# EAGLE schematic Moinak_BLDC (EAGLE 6.5.0)
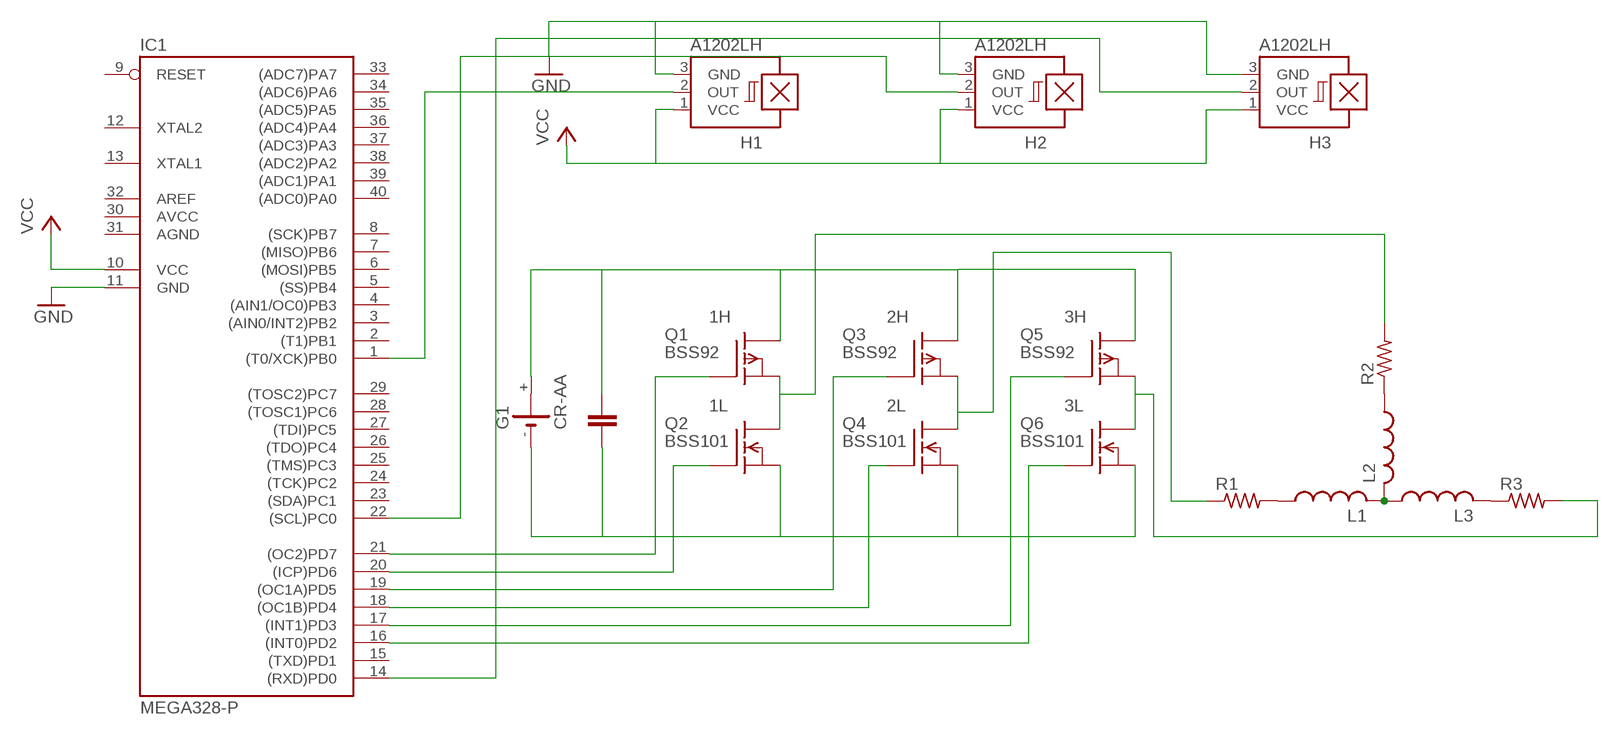
[diagram p0: schematic, sheet 1]

## Parts
G1  CR-AA  [CRAA]
H1  A1202LH  [SOT23-W]
H2  A1202LH  [SOT23-W]
H3  A1202LH  [SOT23-W]
IC1  MEGA328-P  MEGA323-P  [DIL40]
L1  L-USIR-2  [IR-2]
L2  L-USIR-2  [IR-2]
L3  L-USIR-2  [IR-2]
Q1  BSS92  [TO92]
Q2  BSS101  [TO92]
Q3  BSS92  [TO92]
Q4  BSS101  [TO92]
Q5  BSS92  [TO92]
Q6  BSS101  [TO92]
R1  R-US_0309/12  [0309/12]
R2  R-US_0309/12  [0309/12]
R3  R-US_0309/12  [0309/12]

## Nets
1-1': Q3.3(S) Q4.3(D) R1.1
1H: IC1.21((OC2)PD7) Q1.1(G)
1L: G1.- IC1.20((ICP)PD6) Q2.1(S) Q2.2(G) Q4.1(S) Q6.1(S)
2-2\: Q1.3(S) Q2.3(D) R2.2
2H: IC1.19((OC1A)PD5) Q3.1(G)
2L: IC1.18((OC1B)PD4) Q4.2(G)
3H: IC1.17((INT1)PD3) Q5.1(G)
3L: IC1.16((INT0)PD2) Q6.2(G)
GND: H1.3(GND) H2.3(GND) H3.3(GND) IC1.11(GND)
N$1: L2.1 R2.1
N$2: L1.1 R1.2
N$3: L3.2 R3.1
N$4: G1.+ Q1.2(D) Q3.2(D) Q5.2(D)
N$5: Q5.3(S) Q6.3(D) R3.2
N$7: L1.2 L2.2 L3.1
N$15: H1.2(OUT) IC1.1((T0/XCK)PB0)
N$16: H2.2(OUT) IC1.22((SCL)PC0)
N$17: H3.2(OUT) IC1.14((RXD)PD0)
VCC: H1.1(VCC) H2.1(VCC) H3.1(VCC) IC1.10(VCC)
Unconnected: G1.+@1(+) IC1.2((T1)PB1) IC1.3((AIN0/INT2)PB2) IC1.4((AIN1/OC0)PB3) IC1.5((SS)PB4) IC1.6((MOSI)PB5) IC1.7((MISO)PB6) IC1.8((SCK)PB7) IC1.9(RESET) IC1.12(XTAL2) IC1.13(XTAL1) IC1.15((TXD)PD1) IC1.23((SDA)PC1) IC1.24((TCK)PC2) IC1.25((TMS)PC3) IC1.26((TDO)PC4) IC1.27((TDI)PC5) IC1.28((TOSC1)PC6) IC1.29((TOSC2)PC7) IC1.32(AREF) IC1.33((ADC7)PA7) IC1.34((ADC6)PA6) IC1.35((ADC5)PA5) IC1.36((ADC4)PA4) IC1.37((ADC3)PA3) IC1.38((ADC2)PA2) IC1.39((ADC1)PA1) IC1.40((ADC0)PA0)

## Power pins joined to a net without a drawn wire
AGND: IC1.31(AGND)
AVCC: IC1.30(AVCC)

## Library data of the parts
G1 = battery:CR-AA: LI BATTERY Varta CRAA-SLF
H1-H3 = allegro:A12*?: Hall-effect bipolar switch Source: http://www.allegromicro.com/en/Products/Part_Numbers/1202/1202.pdf; OC_FARNELL: unknown; OC_NEWARK: unknown
IC1 = atmel:MEGA323-P: MICROCONTROLLER 32 Kbytes FLASH 2 Kbytes SRAM 1 Kbytes EEPROM USART 8-channel 10 bit ADC Source: avr.lbr; OC_FARNELL: unknown; OC_NEWARK: unknown
L1-L3 = rcl:L-US: INDUCTOR, American symbol
Q1 Q3 Q5 = transistor-fet:BSS92: P-Channel Enhancement MOSFET -200V; -0,15A; 11Ohm
Q2 Q4 Q6 = transistor-fet:BSS101: N-Channel Enhancement MOSFET 200V; 0,16A; 11Ohm
R1-R3 = rcl:R-US_: RESISTOR, American symbol